# Altium project IMU_Board.PrjPcb
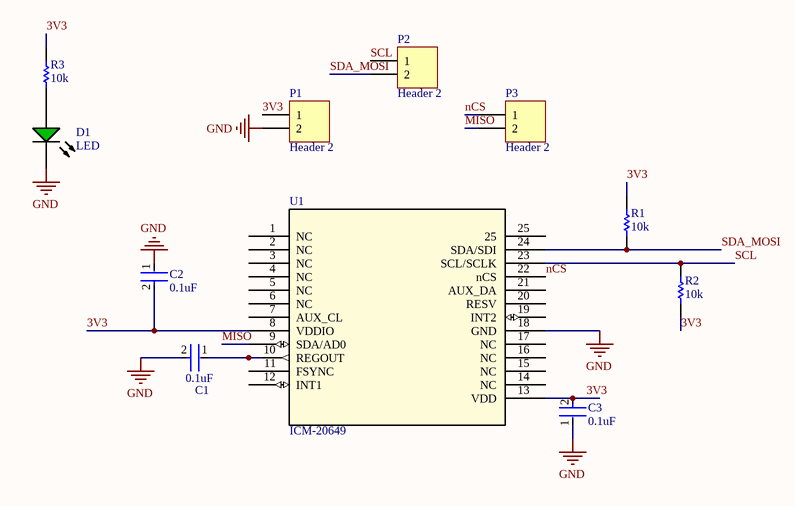
[diagram p0: Custom_IMU_testing.SchDoc]
1 sheet, 11 parts. Net scope: global (net labels, ports and power ports of the same name join across sheets).
Board file: IMU_Board.PcbDoc

## Sheet Custom_IMU_testing.SchDoc
size A0; SheetNumber: 1; SheetTotal: 1

### Parts
C1  0.1uF  [FP-GRM15-MFG]
C2  0.1uF  [FP-GRM15-MFG]
C3  0.1uF  [FP-GRM15-MFG]
D1  LED  [LED-2P-2.54-3MM_V]
P1  Header 2  [HDR1X2]
P2  Header 2  [HDR1X2]
P3  Header 2  [HDR1X2]
R1  10k  [RESC1005X40X25LL05T10]
R2  10k  [RESC1005X40X25LL05T10]
R3  10k  [RESC1005X40X25LL05T10]
U1  ICM-20649  [QFN24_3X3X0P9_IVS]

### Nets
GND: C1.2 C2.1 C3.1 D1.2(K) P1.2 U1.18(GND)
3V3: C2.2 C3.2 P1.1 R1.2 R2.1 R3.2 U1.8(VDDIO) U1.13(VDD)
MISO: P3.2 U1.9(SDA/AD0)
nCS: P3.1 U1.22(nCS)
SCL: P2.1 R2.2 U1.23(SCL/SCLK)
SDA_MOSI: P2.2 R1.1 U1.24(SDA/SDI)
NetC1_1: C1.1 U1.10(REGOUT)
NetD1_1: D1.1(A) R3.1

Not connected (* = marked no-connect by the designer): U1 1(NC) 2(NC) 3(NC) 4(NC) 5(NC) 6(NC) 7(AUX_CL) 11(FSYNC) 12(INT1) 14(NC) 15(NC) 16(NC) 17(NC) 19(INT2) 20(RESV) 21(AUX_DA) 25

### Library data of the parts
C1-C3 = CMP-2100-03641-2: CAP CER 0.1UF 16V X7R 0402; Manufacturer Part Number: GRM155R71C104KA88D; Manufacturer: Murata; Standoff Height: 0mm; Tolerance: 10%; Voltage Rating: 16Vdc; Material: Ceramic; Capacitance: 0.10μF; Value: 0.10μF; RoHS: TRUE; Temperature Characteristic: X7R; Octopart: https://octopart.com/grm155r71c104ka88d-murata-196880; Digikey Description: CAP CER 0.1UF 16V X7R 0402; Device Class L3: Ceramic Capacitors; Height: 0.55mm; ComponentLink2Description: Datasheet; Temperature Range Low: -55°C; Ipc Land Pattern Name: CAPC10050X219; ComponentLink2URL: https://search.murata.co.jp/Ceramy/image/img/A01X/G101/ENG/GRM155R71H471KA01-01A.pdf; Device Class L1: Passive Components; Lead Free: yes; Category: Cap; Package: GRM15; Temperature: -55°C to +125°C; Device Class L2: Capacitors; Temperature Range High: +125°C; Mouser Description: 0402 0.1 uF 16V ±10 % Tolerance X7R SMT Multilayer Ceramic Capacitor
D1 = CMP-2000-05186-1: LED, Green, 2 mA, 1.9 V, -20 to 100 degC, 2-Pin THD, RoHS, Bulk; Manufacturer: Avago; Viewing Angle: 50deg; Number of LEDs: 1; Lens Appearance: ColoredDiffused; Peak Wavelength: 565nm; Dominant Wavelength/Color Temperature: 569nm; Mounting Orientation: TopMount; Rad Hard: No; Lens Shape Type: Circular; Type: Uni-Color; Intensity: 2.3mcd; Package: 2T-1; Packaging: Bulk; Pin Count: 2; Color: Green; Datasheet URL: https://datasheet.ciiva.com/11773/0900766b800204ad-11773539.pdf; Manufacturer URL: http://www.avagotech.com/; Category: LEDs; Mounting: ThroughHole; Datasheet Version: Jul-14
P1-P3 = Header 2: Header, 2-Pin; LatestRevisionDate: 17-Jul-2002; LatestRevisionNote: Re-released for DXP Platform.; Publisher: Altium Limited
R1-R3 = CMP-2002-07353-1: Part Number: RC0402FR-0710KL; Manufacturer: Yageo / Phycomp
U1 = ICM-20649: No Description Available; Mfr_Name: InvenSense; Copyright: Copyright (C) 2023 Ultra Librarian. All rights reserved.; Manufacturer_Part_Number: ICM-20649; RefDes: RefDes; Type: DEV